# Altium schematic sheet DEBUG_CONSOLE.SchDoc
size A3; SheetNumber: 14; SheetTotal: 23
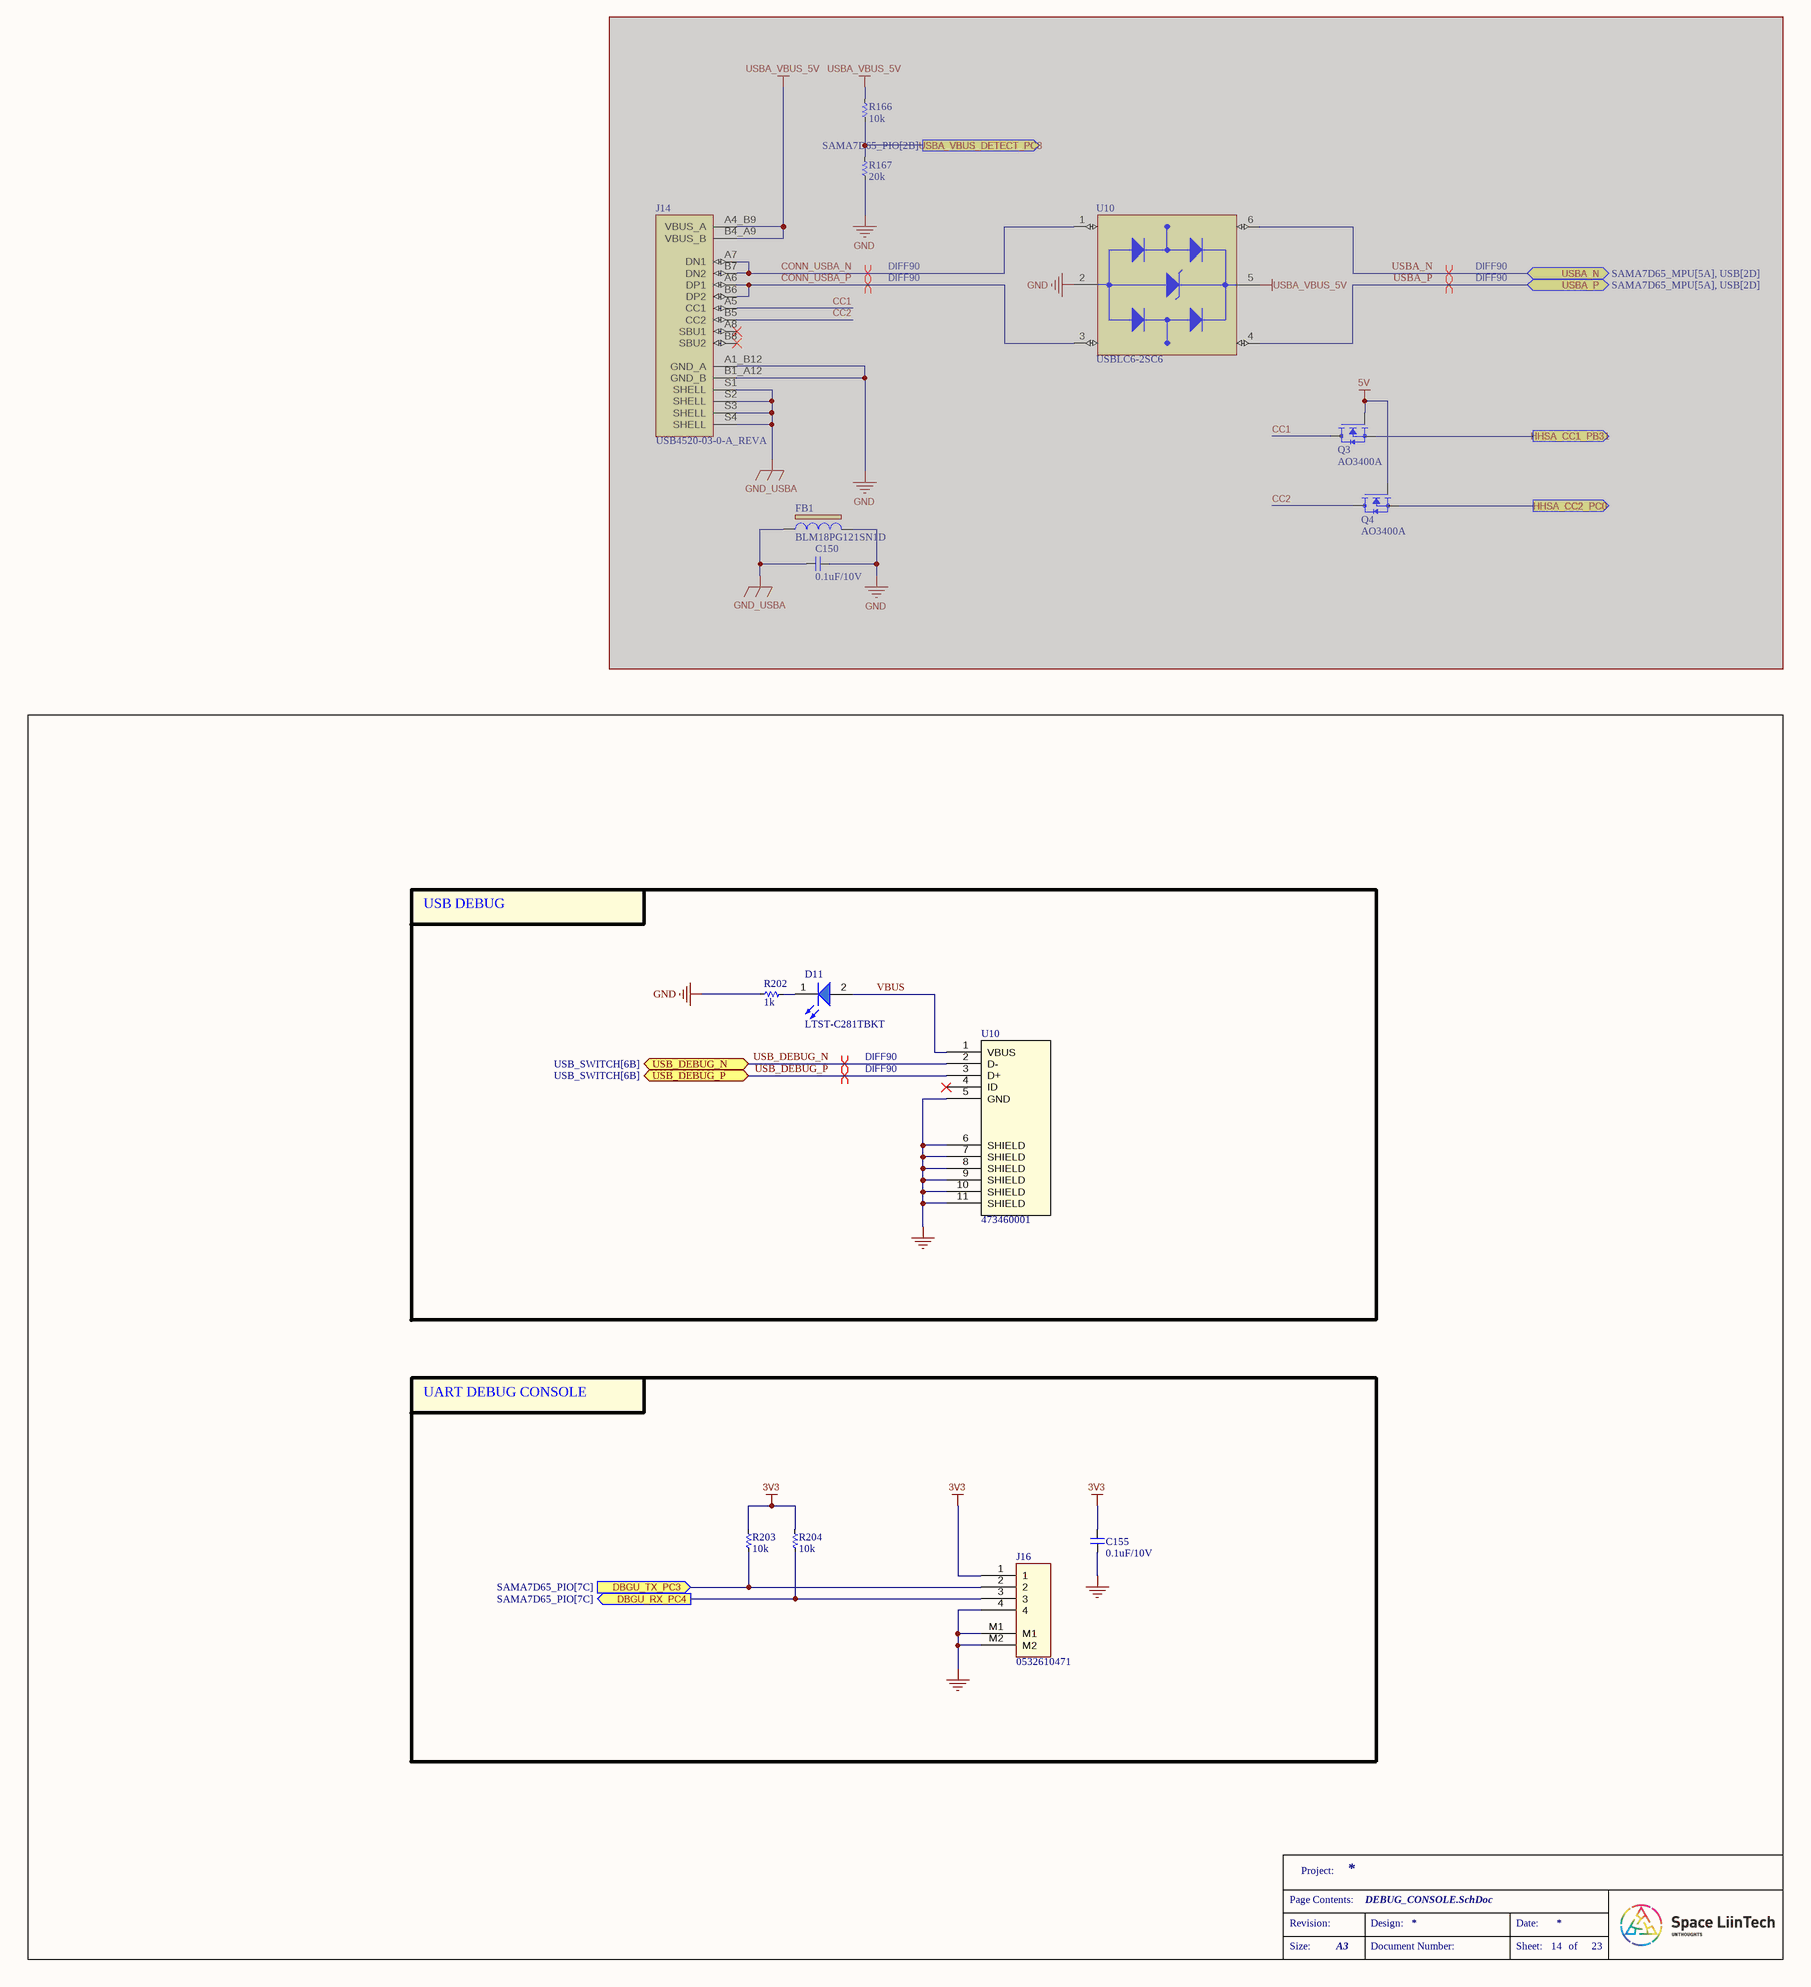
[diagram p0: DEBUG_CONSOLE.SchDoc]

## Parts
(Parts that share a designator on the sheet are numbered #1, #2 ... from top to bottom, then left to right.)
C150  0.1uF/10V  [CAP_C_1005X50_L]  (masked out: inside a compile mask, not in the netlist)
C155  0.1uF/10V  [CAP_C_1005X50_L]
D11  LTST-C281TBKT  [LED_0402]
FB1  BLM18PG121SN1D  [IND_BLM18_0603_MUR]  (masked out: inside a compile mask, not in the netlist)
J14  USB4520-03-0-A_REVA  [GCT_USB4520-03-0-A_REVA]  (masked out: inside a compile mask, not in the netlist)
J16  0532610471  [MOLEX_0532610471]
Q3  AO3400A  [SOT95P280X125-3N]  (masked out: inside a compile mask, not in the netlist)
Q4  AO3400A  [SOT95P280X125-3N]  (masked out: inside a compile mask, not in the netlist)
R166  10k  [RES_C_1005x30_L]  (masked out: inside a compile mask, not in the netlist)
R167  20k  [RES_C_0603X30]  (masked out: inside a compile mask, not in the netlist)
R202  1k  [RES_C_1005x30_L]
R203  10k  [RES_C_1005x30_L]
R204  10k  [RES_C_1005x30_L]
U10#1  USBLC6-2SC6  [SOT95P280X145-6N]  (masked out: inside a compile mask, not in the netlist)
U10#2  473460001  [47346-0001_MOL]

## Blocks framed on the sheet
USB DEBUG: D11 R202 U10#2
UART DEBUG CONSOLE: C155 J16 R203 R204

## Ports
DBGU_RX_PC4 (out, see SAMA7D65_PIO[7C]), DBGU_TX_PC3 (in, see SAMA7D65_PIO[7C]), HHSA_CC1_PB31 (out), HHSA_CC2_PC0 (out), USB_DEBUG_N (bidir, see USB_SWITCH[6B]), USB_DEBUG_P (bidir, see USB_SWITCH[6B]), USBA_N (bidir, see SAMA7D65_MPU[5A], USB[2D]), USBA_P (bidir, see SAMA7D65_MPU[5A], USB[2D]), USBA_VBUS_DETECT_PC8 (out, see SAMA7D65_PIO[2B])

## Nets
3V3: C155.2 J16.1 R203.1 R204.1
GND: C155.1 J16.4 J16.M1 J16.M2 R202.1 U10#2.5(GND) U10#2.6(SHIELD) U10#2.7(SHIELD) U10#2.8(SHIELD) U10#2.9(SHIELD) U10#2.10(SHIELD) U10#2.11(SHIELD)
DBGU_RX_PC4: J16.3 R204.2 ; port DBGU_RX_PC4
DBGU_TX_PC3: J16.2 R203.2 ; port DBGU_TX_PC3
USB_DEBUG_N: U10#2.2(D-) ; port USB_DEBUG_N
USB_DEBUG_P: U10#2.3(D+) ; port USB_DEBUG_P
VBUS: D11.2(A) U10#2.1(VBUS)
NetD11_1: D11.1(K) R202.2

Not connected (* = marked no-connect by the designer): U10#2 4(ID)*

## Layout directives
differential pair; differential pair class DIFF90; net class DIFF90; rule Matched Net Lengths [Tolerance = 4mil]: (no net found under the mark), USB_DEBUG_N, USB_DEBUG_P

## Notes on the sheet
- Project:
- Page Contents:
- Revision:
- Design:
- Date:
- Size:
- A3
- Document Number:
- Sheet:
- of

## Library data of the parts
C150 C155 = _CAP_C_2: CAP CHIP
D11 = LED_BLUE
FB1 = BLM18PG121SN1D: FERRITE BEAD 120 OHM 0603 1LN; Manufacturer_Name: Murata; Copyright: Copyright (C) 2025 Ultra Librarian. All rights reserved.; Manufacturer_Part_Number: BLM18PG121SN1D
J14 = USB4520-03-0-A_REVA: USB-C (USB TYPE-C) USB 2.0 Receptacle Connector 24 (16+8 Dummy) Position Board Edge, Cutout; Surface Mount; Through Hole, Right Angle; MF: Global Connector Technology; SnapEDA_Link: https://www.snapeda.com/parts/USB4520-03-0-A/Global+Connector+Technology/view-part/?ref=snap; Package: None; Value: *; MP: USB4520-03-0-A; Check_prices: https://www.snapeda.com/parts/USB4520-03-0-A/Global+Connector+Technology/view-part/?ref=eda
J16 = Header 4x1_2M
Q3 Q4 = AO3400A: N-Channel 30 V 5.7A (Ta) 1.4W (Ta) Surface Mount SOT-23-3; MF: Alpha & Omega Semiconductor; SnapEDA_Link: https://www.snapeda.com/parts/AO3400A/Alpha/view-part/?ref=snap; Package: SOT-23 Alpha &amp; Omega Semiconductor Inc.; Value: *; MP: AO3400A; Check_prices: https://www.snapeda.com/parts/AO3400A/Alpha/view-part/?ref=eda
R166 R167 R202-R204 = _RES_B_2: RES
U10#1 = USBLC6-2SC6: 17V Clamp 5A (8/20Âµs) Ipp Tvs Diode Surface Mount SOT-23-6; MF: STMicroelectronics; Value: *; SnapEDA_Link: https://www.snapeda.com/parts/USBLC6-2SC6/STMicroelectronics/view-part/?ref=snap; Check_prices: https://www.snapeda.com/parts/USBLC6-2SC6/STMicroelectronics/view-part/?ref=eda; Purchase-URL: https://pricing.snapeda.com/search/part/USBLC6-2SC6/?ref=eda; Price: None; Availability: In Stock; Package: SOT-23-6 STMicroelectronics; MP: USBLC6-2SC6
U10#2 = 473460001: Micro-USB B Receptacle with Flange, Bottom Mount, Surface Mount, Lead-Free; Manufacturer_Name: Molex Connector Corporation; Copyright: Copyright (C) 2025 Ultra Librarian. All rights reserved.; Manufacturer_Part_Number: 473460001; RefDes: RefDes; Type: Type